# Altium schematic sheet mpustm.SchDoc
size A4; SheetNumber: 1; SheetTotal: 2
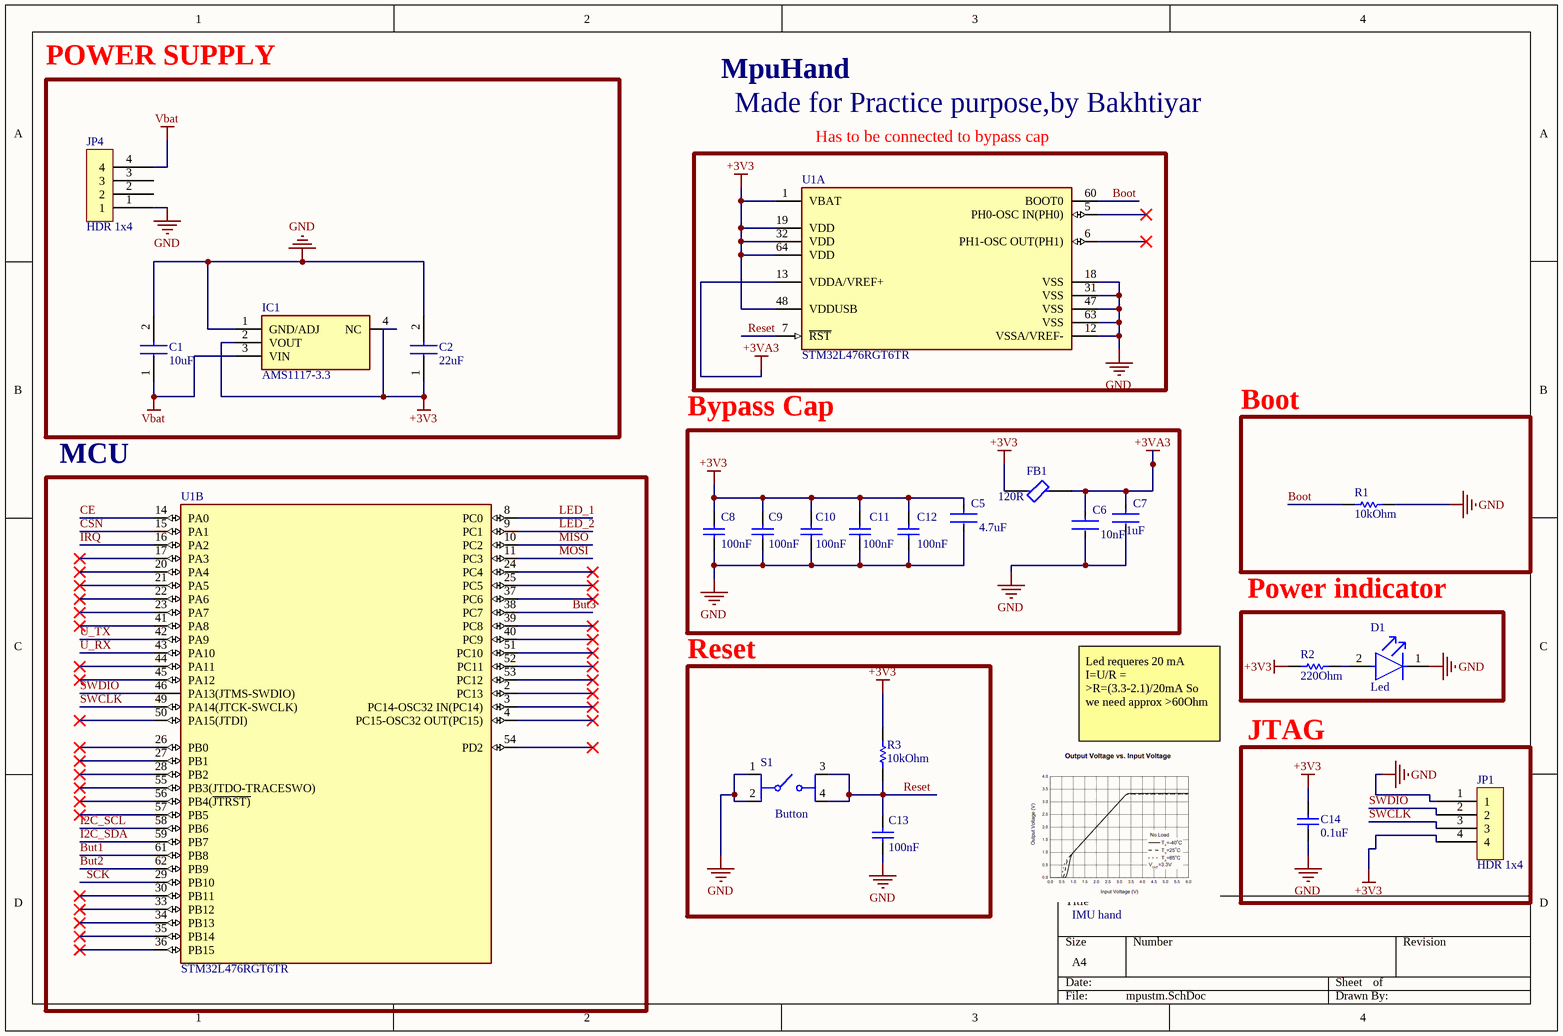
[diagram p0: mpustm.SchDoc]

## Parts
C1  10uF  [CAPC2012X140N]
C2  22uF  [CAPC2012X140N]
C5  4.7uF  [FP-CL282-IPC_C]
C6  10nF  [FP-CL165-IPC_C]
C7  1uF  [FP-CL511-IPC_C]
C8  100nF  [CAPC1050X55X23ML05T13]
C9  100nF  [CAPC1050X55X23ML05T13]
C10  100nF  [CAPC1050X55X23ML05T13]
C11  100nF  [CAPC1050X55X23ML05T13]
C12  100nF  [CAPC1050X55X23ML05T13]
C13  100nF  [CAPC1050X55X23ML05T13]
C14  0.1uF  [CAPC1050X55X23ML05T13]
D1  Led  [FP-LTST-C191GKT-MFG]
FB1  120R  [FP-BLM18-0_15-t0_8-IPC_C]
IC1  AMS1117-3.3  [SOT229P700X180-4N]
JP1  HDR 1x4  [HDR Male1_4 2.54mm]
JP4  HDR 1x4  [HDR Male1_4 2.54mm]
R1  10kOhm  [RESC2013X60X35ML10T20]
R2  220Ohm  [RESC1608X55X25ML10T15]
R3  10kOhm  [RESC2013X60X35ML10T20]
S1  Button  [GSPTS004901]
U1  STM32L476RGT6TR  [FP-LQFP64-5W-MFG]  (parts A,B of 2)

## Blocks framed on the sheet
POWER SUPPLY: C1 C2 IC1 JP4
Has to be connected to bypass cap: U1
Bypass Cap: C5-C12 FB1
Boot: R1
MCU: U1
Power indicator: D1 R2
Reset: C13 R3 S1
JTAG: C14 JP1

## Nets
+3V3: C2.1 C5.1 C8.2 C9.2 C10.2 C11.2 C12.2 C14.2 FB1.1 IC1.2(VOUT) IC1.4(NC) JP1.4 R2.2 R3.2 U1.1(VBAT) U1.19(VDD) U1.32(VDD) U1.48(VDDUSB) U1.64(VDD)
+3VA3: C6.1 C7.1 FB1.2 U1.13(VDDA/VREF+)
GND: C1.2 C2.2 C5.2 C6.2 C7.2 C8.1 C9.1 C10.1 C11.1 C12.1 C13.1 C14.1 D1.1(C) IC1.1(GND/ADJ) JP1.1 JP4.1 R1.1 S1.1(COM_1) S1.2(COM_2) U1.12(VSSA/VREF-) U1.18(VSS) U1.31(VSS) U1.47(VSS) U1.63(VSS)
Vbat: C1.1 IC1.3(VIN) JP4.4
Boot: R1.2 U1.60(BOOT0)
But1: U1.61(PB8)
But2: U1.62(PB9)
But3: U1.38(PC7)
CE: U1.14(PA0)
CSN: U1.15(PA1)
I2C_SCL: U1.58(PB6)
I2C_SDA: U1.59(PB7)
IRQ: U1.16(PA2)
LED_1: U1.8(PC0)
LED_2: U1.9(PC1)
MISO: U1.10(PC2)
MOSI: U1.11(PC3)
Reset: C13.2 R3.1 S1.3(NO_1) S1.4(NO_2) U1.7(~{RST})
SCK: U1.29(PB10)
SWCLK: JP1.3 U1.49(PA14(JTCK-SWCLK))
SWDIO: JP1.2 U1.46(PA13(JTMS-SWDIO))
U_RX: U1.43(PA10)
U_TX: U1.42(PA9)
NetD1_2: D1.2(A) R2.1

Not connected (* = marked no-connect by the designer): JP4 2 3; U1 2(PC13)* 3(PC14-OSC32_IN(PC14))* 4(PC15-OSC32_OUT(PC15))* 5(PH0-OSC_IN(PH0))* 6(PH1-OSC_OUT(PH1))* 17(PA3)* 20(PA4)* 21(PA5)* 22(PA6)* 23(PA7)* 24(PC4)* 25(PC5)* 26(PB0)* 27(PB1)* 28(PB2)* 30(PB11)* 33(PB12)* 34(PB13)* 35(PB14)* 36(PB15)* 37(PC6)* 39(PC8)* 40(PC9)* 41(PA8)* 44(PA11)* 45(PA12)* 50(PA15(JTDI))* 51(PC10)* 52(PC11)* 53(PC12)* 54(PD2)* 55(PB3(JTDO-TRACESWO))* 56(PB4(~{JTRST)})* 57(PB5)*

## Notes on the sheet
- MpuHand
- Made for Practice purpose,by Bakhtiyar
- Led requeres 20 mA I=U/R = >R=(3.3-2.1)/20mA So we need approx >60Ohm
- IMU hand

## Library data of the parts
C1 = CL21A106KOQNNNE: Capacitor; Manufacturer_Name: SAMSUNG; Datasheet Link: https://datasheet.datasheetarchive.com/originals/distributors/Datasheets_SAMA/0289c6d4f30f89b64e7dd5b6a9ee99f0.pdf; Height: 1.4mm; Manufacturer_Part_Number: CL21A106KOQNNNE; Mouser Part Number: 187-CL21A106KOQNNNE; Mouser Price/Stock: https://www.mouser.co.uk/ProductDetail/Samsung-Electro-Mechanics/CL21A106KOQNNNE?qs=349EhDEZ59qKIX0T0PKtPw%3D%3D; Arrow Part Number: CL21A106KOQNNNE; Arrow Price/Stock: https://www.arrow.com/en/products/cl21a106koqnnne/samsung-electro-mechanics?utm_currency=USD&region=nac
C2 = CL21A226MQQNNNE: Capacitor; Manufacturer_Name: SAMSUNG; Datasheet Link: http://product.samsungsem.com/mlcc/basic-search.do?partNumber=CL21A226MQQNNN; Height: 1.4mm; Manufacturer_Part_Number: CL21A226MQQNNNE; Mouser Part Number: 187-CL21A226MQQNNNE; Mouser Price/Stock: https://www.mouser.co.uk/ProductDetail/Samsung-Electro-Mechanics/CL21A226MQQNNNE?qs=349EhDEZ59oZnQF%252BO1HZ%252BQ%3D%3D; Arrow Part Number: CL21A226MQQNNNE; Arrow Price/Stock: https://www.arrow.com/en/products/cl21a226mqqnnne/samsung-electro-mechanics.html?utm_currency=USD&region=nac
C5 = CMP-13271-000548-1: Cap Ceramic 4.7uF 10V X5R ±20% SMD 0402 +85°C Paper T/R; Capacitance: 4.7uF; Max Operating Temperature: 85°C; Lead Free: Lead Free; Tolerance: 20%; Voltage Rating: 10V; Dielectric: X5R; Width: 0.02inch; Length: 0.039inch; Case/Package: 0402; Min Operating Temperature: -55°C; Packaging: Tape and Reel; Thickness: 0.022inch; Case Code (Imperial): 0402; Package Quantity: 10000; Case Code (Metric): 1005; Mount: Surface Mount
C6 = CMP-13271-000387-1: Cap Ceramic 10nF 50V X7R ±10% SMD 0402 +125°C Paper T/R; Depth: 0.5mm; Length: 1mm; Lead Free: Lead Free; Case Code (Metric): 1005; Width: 0.02inch; Min Operating Temperature: -55°C; Thickness: 0.022inch; Package Quantity: 1; Mount: Surface Mount; Height: 0.5mm; Voltage: 50V; Material: Ceramic; Tolerance: 10%; Case Code (Imperial): 0402; Radiation Hardening: No; Case/Package: 0402; Max Operating Temperature: 125°C; Voltage Rating (DC): 50V; Contact Plating: Tin; Packaging: Tape and Reel; Voltage Rating: 50V; Capacitance: 10nF; Dielectric: X7R
C7 = CMP-13271-001936-1: Cap Ceramic 1uF 10V X5R ±10% SMD 0402 +85°C Paper T/R; Depth: 0.5mm; Case Code (Imperial): 0402; Material: Ceramic; Mount: Surface Mount; Thickness: 0.022inch; Dielectric: X5R; Capacitance: 1uF; Radiation Hardening: No; Case/Package: 0402; Length: 1mm; Tolerance: 10%; Max Operating Temperature: 85°C; Package Quantity: 1; Width: 0.02inch; Voltage Rating: 10V; Contact Plating: Tin; Height: 0.5mm; Min Operating Temperature: -55°C; Case Code (Metric): 1005; Packaging: Tape and Reel
C8-C14 = CMP-2000-05439-1: Chip Capacitor, 100 nF, +/- 10%, 16 V, -55 to 125 degC, 0402 (1005 Metric), RoHS, Tape and Reel; Manufacturer: Samsung Electro-Mechanics; Capacitance: 100000pF; Dielectric: X7R; Rated Voltage: 16V; Case Size/Dimension: 0402; Tolerance (%): ±10%; Manufacturer URL: http://www.samsungsem.com/global/index.jsp; Datasheet URL: https://datasheet.ciiva.com/29198/458718-da-01-en-vs-kondensator-0402-29198423.pdf; Datasheet Version: Nov-10
D1 = CMP-22017-000029-1: LED GREEN CLEAR CHIP SMD; Power Dissipation: 100mW; Lens Color: Colorless; Number of Elements: 1; Dominant Wavelength: 569nm; Forward Voltage: 2.1V; Forward Current: 30mA; Test Current: 20mA; Viewing Angle: 130°; Wavelength: 565nm; Luminous Intensity: 12mcd; Reverse Voltage: 5V; Case/Package: 0603; Package Quantity: 1; Illumination Color: Green; Lens Style: Clear; Lens Transparency: Clear; Depth: 0.8mm; Power Rating: 100mW; Width: 0.8mm; Height: 0.55mm; Radiation Hardening: No; Case Code (Imperial): 0603; Number of Pins: 2; Length: 1.6mm; Case Code (Metric): 1608; Max Operating Temperature: 85°C; Color: Green; Packaging: Tape and Reel; Mount: Surface Mount; Min Operating Temperature: -55°C; Lead Free: Lead Free; Number of LEDs: 1
FB1 = CMP-0686-00425-3: Chip Ferrite Bead, 0603, 5Ω @ 100MHz, 0.05Ω, 25%, 800mA; Shielding: Unshielded; Impedance: 5R; Max Current Rating: 700mA; DC Resistance (DCR): 50mR; Number of Lines: 1; Number of Pins: 2; Case Code (Metric): 1608; Radiation Hardening: No; Case Code (Imperial): 0603; Width: 0.8mm; Case/Package: 0603; Min Operating Temperature: -55°C; Test Frequency: 100MHz; Material: Ferrite; Package Quantity: 1; DC Current: 700mA; Lead Free: Lead Free; Number of Circuits: 1; Length: 1.6mm; Current Rating: 700mA; Military Standard: Not; Packaging: Tape and Reel; Max DC Current: 700mA; Height: 0.8mm; Depth: 0.8mm; Core Material: Ferrite; Tolerance: 25%; REACH SVHC: No SVHC; Termination: SMD/SMT; Max Operating Temperature: 125°C
IC1 = AMS1117-3.3: Integrated Circuit; Manufacturer_Name: Advanced; Datasheet Link: https://datasheet.datasheetarchive.com/originals/distributors/Datasheets-28/DSA-550594.pdf; Height: 1.8mm; Manufacturer_Part_Number: AMS1117-3.3
JP1 JP4 = 68001-204HLF: CONN HEADER VERT 4POS 2.54MM; Manufacturer: Amphenol FCI; Current Rating: 3A; Voltage Rating: 1.5kV; Connector Type: Male Pin; Gender: Male; Number of Positions: 4; Insulation Resistance: 5GR; Contact Post Length: 3.05mm; Manufacturer Part Number: 68001-204HLF; RoHS: Yes; Category: Headers and Wire Housings; Stock 1: 2857; Pricing 1: 1=0,38000, 10=0,35700, 100=0,25010, 500=0,21442, 1000=0,17868, 5000=0,15315, 10000=0,14294 (USD); Mount: Through Hole; Color: Black; Contact Plating: Gold,GXT; Contact Material: Bronze; Housing Material: Thermoplastic; Min Operating Temperature: -65°C; Max Operating Temperature: 125°C; Package Quantity: 100; Number of Rows: 1; Packaging: Bulk; Contact Gender: Male; Termination: Solder; Number of Contacts: 4; Orientation: Straight; Pitch: 2.54mm; Contact Mating Length: 0.23inch; Radiation Hardening: No; Flammability Rating: UL94 V-0; ComponentLink1URL: https://datasheet.ciiva.com/5164/68000-274255-5164127.pdf?src-supplier=Mouser; ComponentLink1Description: https://datasheet.ciiva.com/5164/68000-274255-5164127.pdf?src-supplier=Mouser; ComponentLink2URL: https://datasheet.ciiva.com/726/68000-726529.pdf?src-supplier=Digi-Key; ComponentLink2Description: https://datasheet.ciiva.com/726/68000-726529.pdf?src-supplier=Digi-Key; Supplier 1: Digi-Key; Supplier Part Number 1: 609-3402-ND
R1 R3 = CMP-2000-05025-1: Chip Resistor, 10 KOhm, +/- 5%, 0.125 W, -55 to 155 degC, 0805 (2012 Metric), RoHS, Tape and Reel; Manufacturer: Yageo; Resistor Element Type: ThickFilm; Voltage Rating: 150V; Product Range: RCSeries; SVHC: ToBeAdvised; Resistor Case Style: 0805[2012Metric]; Temperature Coefficient: ±100ppm/degC; Power Rating: 250mW; Automotive Qualification Standard: -; Datasheet Version: REV. 2, 09/2004; Packaging: CutTape; Resistance Tolerance: ±5%; MSL: MSL1-Unlimited; Manufacturer URL: http://www.yageo.com/; Resistance: 10kohm; Datasheet URL: http://www.yageo.ru/pdf/RC0805.pdf; Package Description: 2-Pin Surface Mounted Device, Body 2 x 1.25 mm; Package Reference: 805
R2 = CMP-1659-00018-2: General Purpose Chip Resistors, 220 Ohm, +/- 1%, -55 to 155 degC, 0603 (1608 Metric), RoHS, Tape and Reel; RoHSCompliant: false; DatasheetVersion: Rev. 4, 04/2009; ComponentLink2Description: Datasheet; ComponentLink2URL: https://datasheet.ciiva.com/11808/0900766b80f96399-11808136.pdf; ComponentLink1URL: http://www.yageo.com/; ComponentLink1Description: Manufacturer URL; PackageReference: 0603; PackageDescription: 2-Pin Surface Mount Device, Body 1.6 x 0.8 mm
S1 = GSPTS004901: Switch (4-Pin Push); Manufacturer_Name: C & K COMPONENTS; Datasheet Link: https://www.ckswitches.com/media/2780/pts526.pdf; Height: 1.65mm; Manufacturer_Part_Number: GSPTS004901
U1 = CMP-12105-000039-1: IC MCU 32BIT 1MB FLASH 64LQFP; Manufacturer: STMicroelectronics; Number Of Timers/Counters: 13; Number Of Spi Channels: 3; Number Of Pwm Channels: 28; Number Of Usb Channels: 1; Frequency: 80MHz; Data Bus Width: 32bits; Max Supply Voltage: 3.6V; Ram Size: 128KBytes; Memory Size: 1MBytes; Number Of Uart Channels: 6; Number Of Adc Channels: 16; Core Architecture: ARM Cortex-M4; Standoff Height: 0.05mm; Interface: I2C,SPI,UART,USART,CAN,USB,LIN,IrDA,SMBus,Other; Max Junction Temp: +105°C; Min Supply Voltage: 1.71V; Number Of I/Os: 51; Temperature Range Low: -40°C; Automotive: No; Ambient Temperature Range Low: -40°C; ComponentLink2URL: https://www.st.com/content/ccc/resource/technical/document/datasheet/c5/ed/2f/60/aa/79/42/0b/DM00108832.pdf/files/DM00108832.pdf/jcr:content/translations/en.DM00108832.pdf; Temperature: -40°C to +105°C; Device Class L1: Integrated Circuits (ICs); Package: LQFP64-5W; Category: IC; Memory Type: FLASH; Digikey Description: IC MCU 32BIT 1MB FLASH 64LQFP; Number Of A/D Converters: 3; Number Of I2C Channels: 3; Temperature Range High: +105°C; Lead Free: Yes; Number Of Cores: 1; Height: 1.6mm; Ambient Temperature Range High: +85°C; Device Class L2: Embedded Processors and Controllers; Octopart: https://octopart.com/stm32l476rgt6tr-stmicroelectronics-74146120; RoHS: TRUE; Ipc Land Pattern Name: QFP50P1200X1200X160-64; Mouser Description: MCU 32-Bit STM32 ARM Cortex M4 RISC 1MB Flash 1.8V/2.5V/3.3V 64-Pin LQFP T/R; ComponentLink2Description: Datasheet; Manufacturer Part Number: STM32L476RGT6TR; Device Class L3: Microcontrollers